# Altium schematic sheet M4F_MCU_Antennas.SchDoc: M4F_MCU_Antennas
size Letter; DrawnBy: D. Fusi; DocumentNumber: 6; Revision: DVT; SheetNumber: 6; SheetTotal: 7
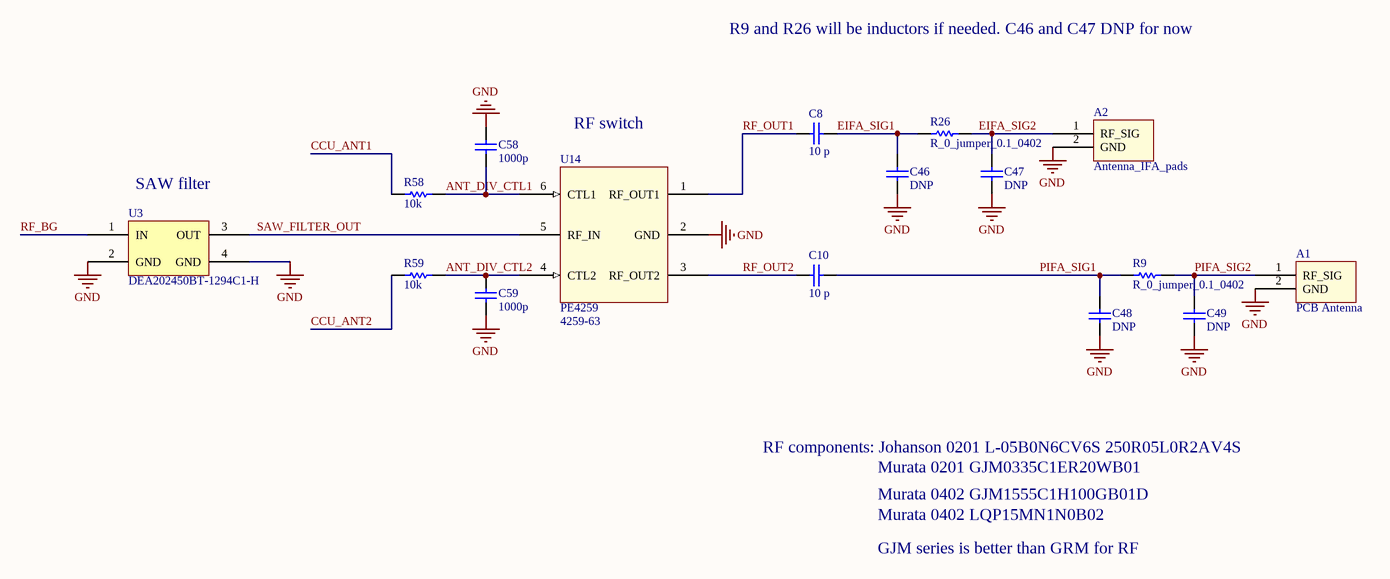
[diagram p0: M4F_MCU_Antennas.SchDoc]

## Parts
A1  PCB Antenna  [Antenna_meander_2.4GHz_middle]  (net tie, no BOM)
A2  Antenna_IFA_pads  [Antenna_Pads]
C8  10 p  [CAP0402_SENSE_DVT]
C10  10 p  [CAP0402_SENSE_DVT]
C46  DNP  [CAP0402_SENSE_DVT]
C47  DNP  [CAP0402_SENSE_DVT]
C48  DNP  [CAP0402_SENSE_DVT]
C49  DNP  [CAP0402_SENSE_DVT]
C58  1000p  [CAP0402_SENSE_DVT]
C59  1000p  [CAP0402_SENSE_DVT]
R9  R_0_jumper_0.1_0402  [RES0402-SENSE-DVT]
R26  R_0_jumper_0.1_0402  [RES0402-SENSE-DVT]
R58  10k  [RES0402_SENSE_DVT]
R59  10k  [RES0402_SENSE_DVT]
U3  DEA202450BT-1294C1-H  [DEA202450BT-1294C1-H]
U14  PE4259  PN: 4259-63  [SOT65P212X110-6N]

## Nets
GND: A1.2(GND) A2.2(GND) C46.2 C47.2 C48.2 C49.2 C58.1 C59.1 U3.2(GND) U3.4(GND) U14.2(GND)
ANT_DIV_CTL1: C58.2 R58.2 U14.6(CTL1)
ANT_DIV_CTL2: C59.2 R59.2 U14.4(CTL2)
CCU_ANT1: R58.1
CCU_ANT2: R59.1
EIFA_SIG1: C8.2 C46.1 R26.1
EIFA_SIG2: A2.1(RF_SIG) C47.1 R26.2
PIFA_SIG1: C10.2 C48.1 R9.1
PIFA_SIG2: A1.1(RF_SIG) C49.1 R9.2
RF_BG: U3.1(IN)
RF_OUT1: C8.1 U14.1(RF_OUT1)
RF_OUT2: C10.1 U14.3(RF_OUT2)
SAW_FILTER_OUT: U3.3(OUT) U14.5(RF_IN)

## Notes on the sheet
- R9 and R26 will be inductors if needed. C46 and C47 DNP for now
- RF switch
- (near U3) SAW filter
- RF components: Johanson 0201 L-05B0N6CV6S 250R05L0R2AV4S
- Murata 0201 GJM0335C1ER20WB01
- Murata 0402 GJM1555C1H100GB01D
- Murata 0402 LQP15MN1N0B02
- GJM series is better than GRM for RF
- TITLE
- DATE
- DRAWN BY
- REV
- SHEET
- OF

## Library data of the parts
A1 = Antenna_meander_2.4GHz_middle: Meander antenna printed on PCB
A2 = Antenna_IFA_pads: PCB pads for external IFA
C8 C10 = C_10p_2_50_C0G_0402: Chip capacitor; Vendor: Murata; PN: GJM1555C1H100GB01D; Tolerance: 2 %; Voltage: 50 V; Temp: C0G; Hello_PN: 225-00348; Value: 10 p; Size: 0402; item_category: Capacitor
C46-C49 = C_2.2p_0.05_50_C0G_0402: Chip capacitor; Value: 2.2 p; Vendor: Murata; PN: GRM1555C1H2R2WA01D; Tolerance: 0.05; Voltage: 50 V; Temp: C0G; Hello_PN: 225-00236; Size: 0402; item_category: Capacitor
C58 C59 = C_1000p_10_50_X7R_0402: Chip capacitor; Vendor: Murata; PN: GRM155R71H102KA01D; Tolerance: 10%; Voltage: 50V; Temp: X7R; Hello_PN: 225-00272; Value: 1000p; Size: 0402; item_category: Capacitor
R9 R26 = R_0_jumper_0.1_0402: Chip Resistor; Value: 0; Vendor: Panasonic; Tolerance: Jumper; Power: 0.1 W; PN: ERJ-2GE0R00X; Hello_PN: 220-00408; Model: *; Size: 0402; item_category: Resistor
R58 R59 = R_10k_5_0.1_0402: Chip Resistor; Vendor: Panasonic; Tolerance: 5 %; Power: 0.1 W; PN: ERJ-2GEJ103X; Hello_PN: 220-00409; Model: *; Value: 10k; Size: 0402; item_category: Resistor
U3 = DEA202450BT-1294C1-H: SAW filter for 2.4 GHz WLAN; Vendor: TDK; Hello_PN: 265-00216; item_category: IC Mixed Signal; PN: DEA202450BT-1294C1-H
U14 = PE4259: RF Switch; Vendor: Peregrine semiconductor; Hello_PN: 270-00292; item_category: RF Component